# Altium schematic sheet RegulatorPower.SchDoc
size A
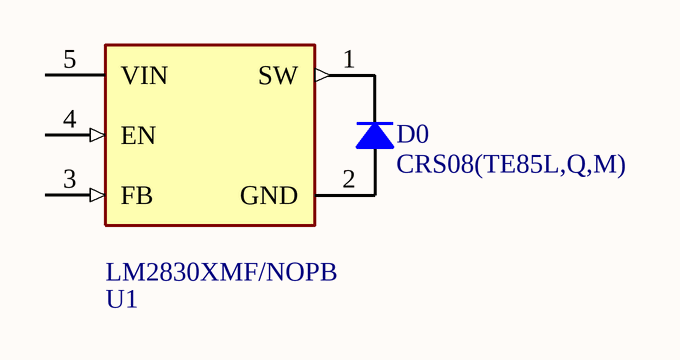
[diagram p0: RegulatorPower.SchDoc]

## Parts
D0  CRS08(TE85L,Q,M)  [SOD123F]
U1  LM2830XMF-NOPB  (value not drawn)

## Nets
NetD0_1: D0.1 U1.2(GND)
NetD0_2: D0.2 U1.1(SW)

Not connected (* = marked no-connect by the designer): U1 3(FB) 4(EN) 5(VIN)

## Library data of the parts
D0 = CRS08(TE85L,Q,M): DIODE SCHOTTKY 30V 1.5A SFLAT; Manufacturer: Toshiba Semiconductor and Storage; Capacitance @ Vr, F: 90pF @ 10V, 1MHz; Current - Reverse Leakage @ Vr: 1mA @ 30V; Speed: Fast Recovery =< 500ns, > 200mA (Io); Voltage - Forward (Vf) (Max) @ If: 360mV @ 1.5A; Part Number: CRS08(TE85L,Q,M); ComponentLink1Description: Datasheet; ComponentLink1URL: //media.digikey.com/pdf/Data%20Sheets/Toshiba%20PDFs/CRS08_Nov1,2013.pdf; ComponentLink2Description: DigiKey Link; ComponentLink2URL: http://digikey.com/product-detail/en/toshiba-semiconductor-and-storage/CRS08-TE85LQM/CRS08QMCT-ND/871562; Current - Average Rectified (Io): 1.5A; Device Package: SOD-123F; Diode Type: Schottky; LastUpdated: 1/21/2020 2:43:31 AM; Lifecycle Status: Active; Minimum Order: 1; Mounting Type: Surface Mount; Operating Temperature - Junction: -40°C ~ 125°C; Package / Case: SOD-123F; Packaging: TapeAndReel; PartId: 2495; Part Status: Active; Price: 0.14; Series: -; Supplier 1: DigiKey; Supplier Part Number 1: CRS08QMCT-ND; Supplier Device Package: S-FLAT (1.6x3.5); Voltage - DC Reverse (Vr) (Max): 30V
U1 = LM2830XMF-NOPB: Part Number: LM2830XMF/NOPB